# EasyEDA Pro project 直插式交直流电流检测.epro

# Schematic Schematic3_1
Board Name: 基于CC6920的电流采样; Create Date: 2026-01-25; Page Name: P1; Project Name: 逆变集成板; Schematic Name: Schematic3_1; Update Date: 2026-01-25; Company: Werner; Page Size: A4; Version: V1.0
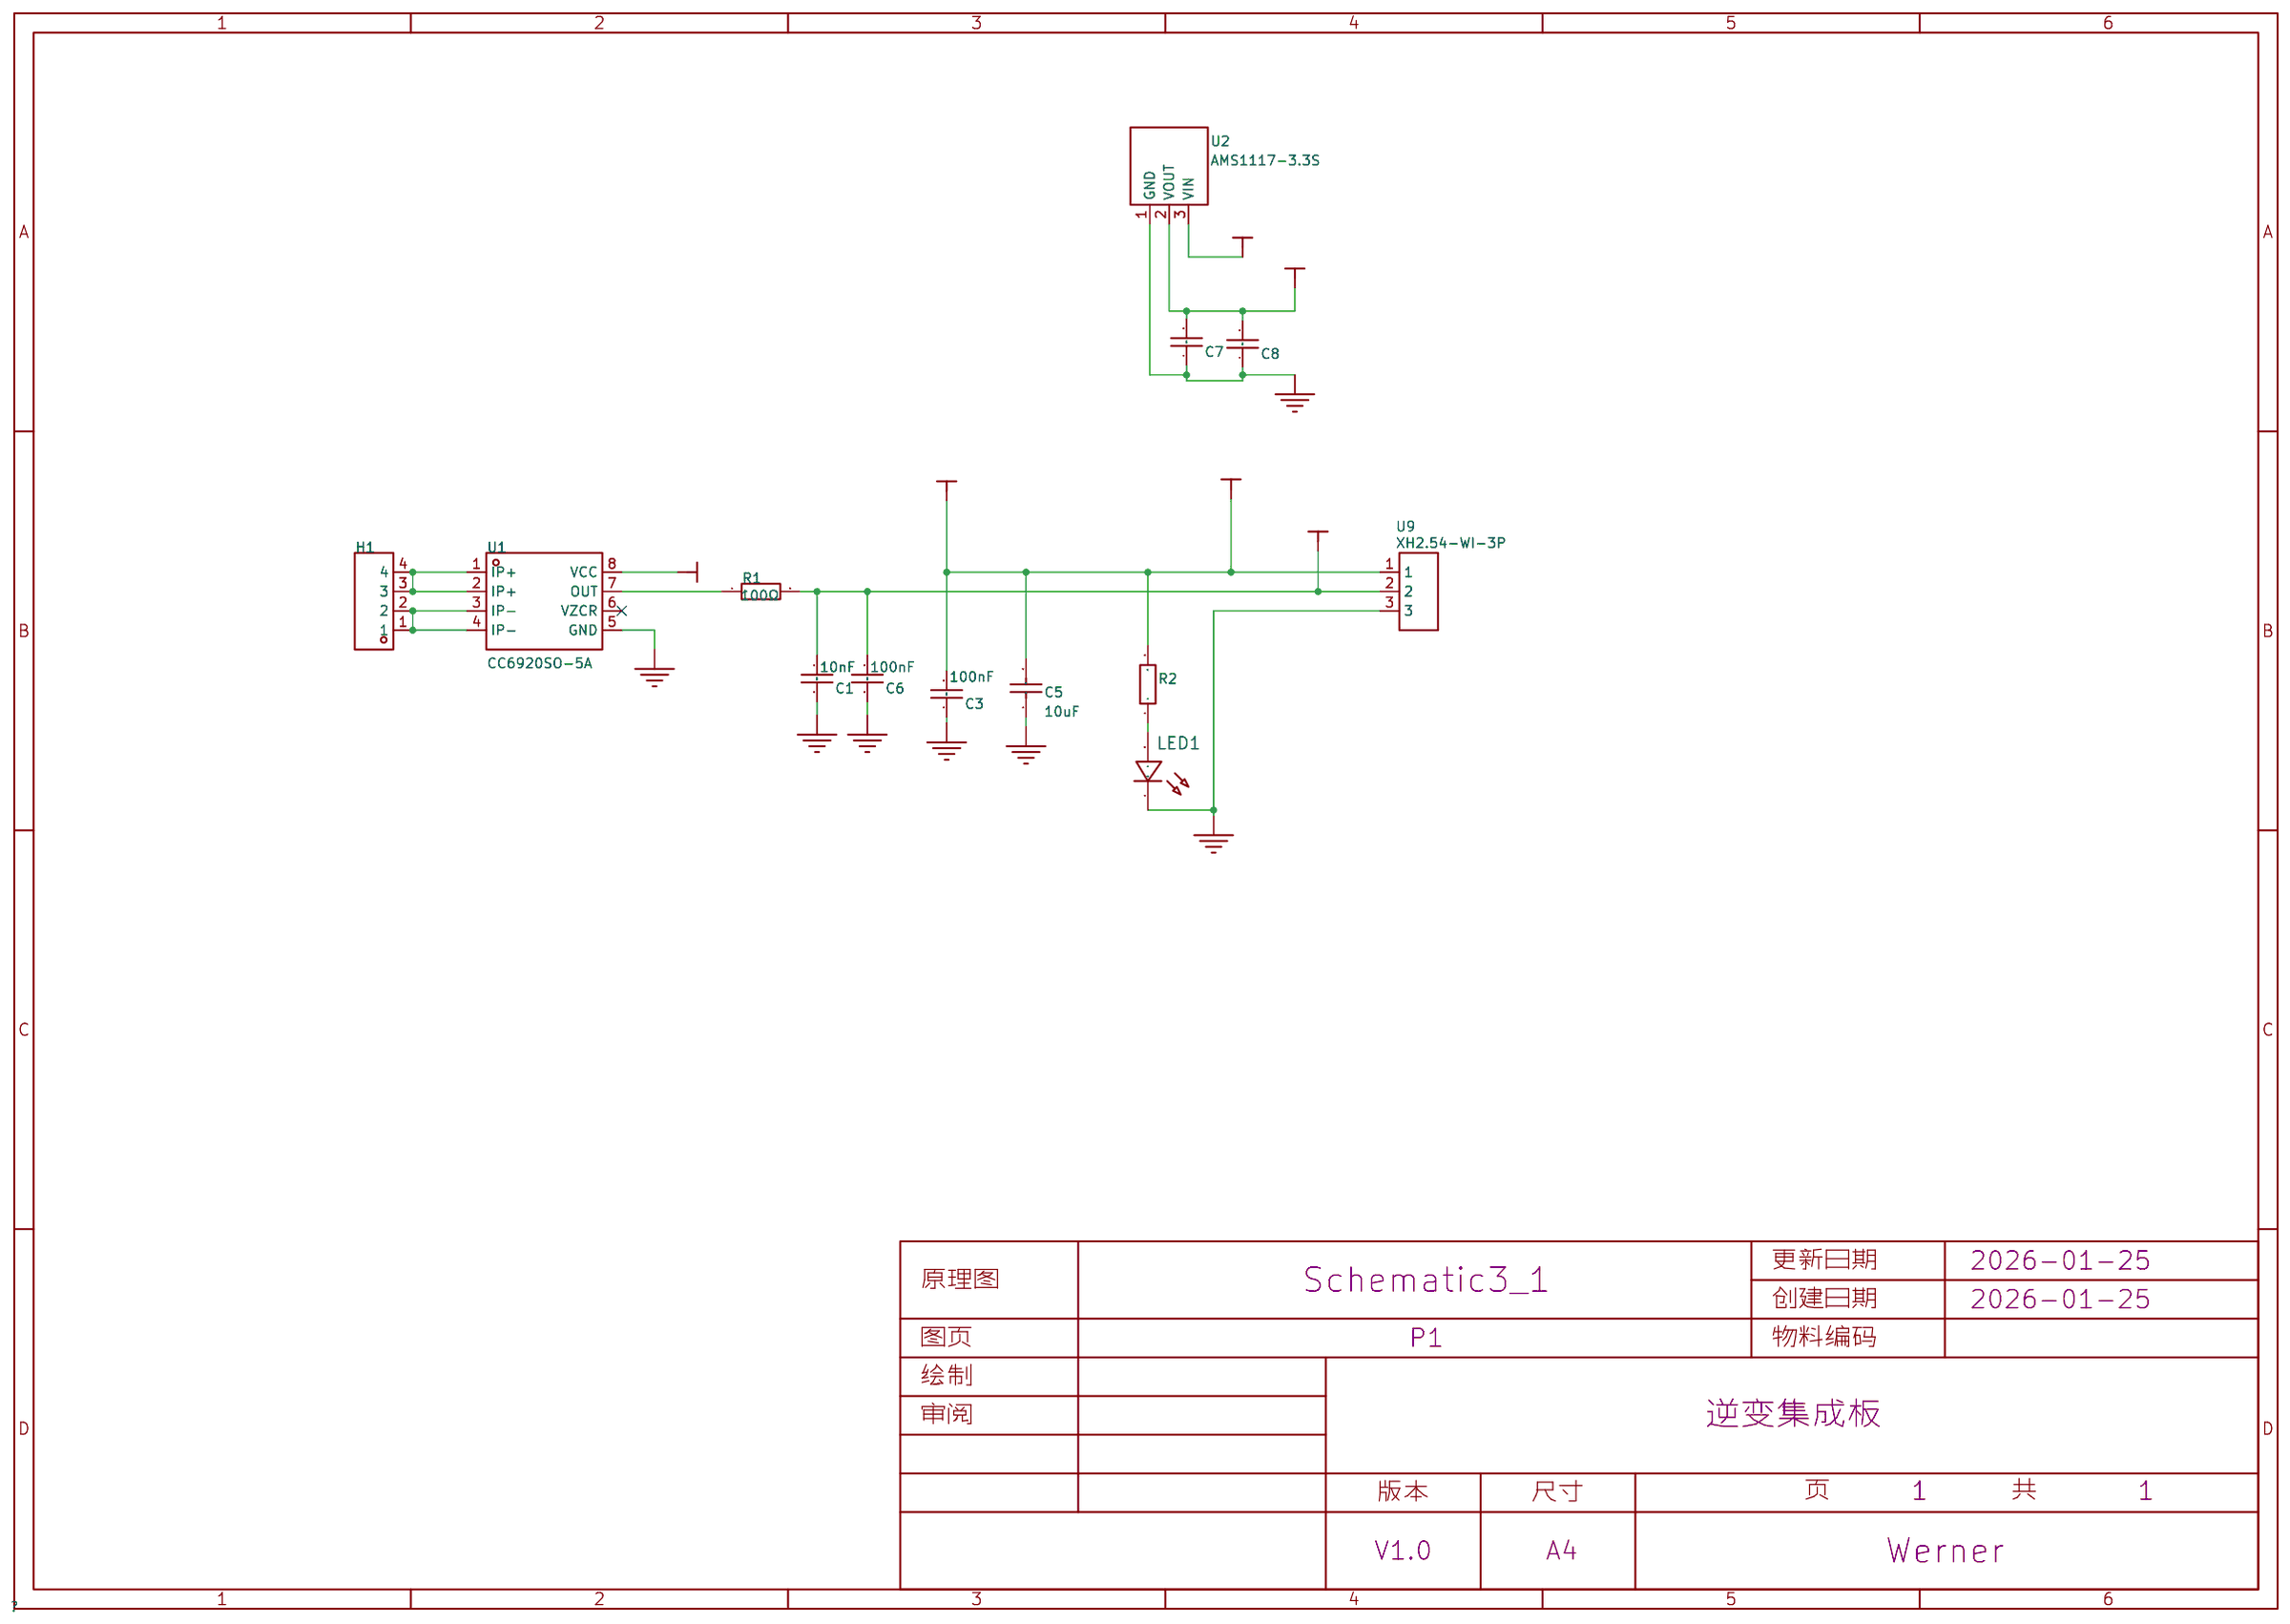
[diagram p0: schematic sheet]

## Parts
C1  10nF  [C0603]
C3  100nF  [C0603]
C5  10uF  [C0603]
C6  100nF  [C0603]
C7  -  [C0603]
C8  -  [C0603]
H1  PZ254V-11-04P  [HDR-TH_4P-P2.54-V-M]
LED1  -  [LED_604]
R1  100Ω  [Res_0603]
R2  -  [Res_0603]
U1  CC6920SO-5A  [SOP-8_L4.9-W3.9-P1.27-LS6.0-BL]
U2  AMS1117-3.3S  [SOT-89-3_L4.5-W2.5-P1.50-LS4.2-BR]
U9  XH2.54-WI-3P  [CONN-TH_XH2.54-WI-3P]

## Library data of the parts
C1 C3 C6-C8 = C0603
C5 = C1206: LCSC Part Name: 100nF ±10% 50V; Supplier Part: C24497; Manufacturer: SAMSUNG(三星); Manufacturer Part: CL31B104KBCNNNC; Supplier Footprint: 1206; JLCPCB Part Class: Basic Part; Datasheet: https://atta.szlcsc.com/upload/public/pdf/source/20160218/1457707763339.pdf; Supplier: LCSC; Tolerance: ±10%; Voltage Rated: 50V; Temperature Coefficient: X7R
H1 = PZ254V-11-04P: LCSC Part Name: 间距:2.54mm 1x4P 直插 方针; Supplier Part: C2691448; Manufacturer: XFCN(兴飞); Supplier Footprint: 插件,P=2.54mm; JLCPCB Part Class: 扩展库; Datasheet: https://atta.szlcsc.com/upload/public/pdf/source/20200309/C492403_F9F19131791D08044AD4F84F8E751A34.pdf; Supplier: LCSC; Pin Structure: 1x4P; Pitch: 2.54mm; Circluar Pins/Square Pins: 方针; Mounting Type: 直插; Number of Rows: 单排; Number of Pins: 4P; Current Rating (Max): 3A; Voltage Rating (Max): 250V; Length of Mating Pin: 6mm; Insulation Height: 2.5mm; Length of End Connection Pin: 3mm; Operating Temperature Range: -40℃~+105℃; Color: 黑色
LED1 = LED_0603-R_1: Supplier Footprint: 0603
R1 R2 = R0603
U1 = CC6920SO-5A: Supplier Part: C2760487; Manufacturer: CrossChip(成都芯进); Supplier Footprint: SOP-8; JLCPCB Part Class: 扩展库; Datasheet: https://item.szlcsc.com/datasheet/CC6920SO-5A/2881674.html; Supplier: LCSC; Current Range: -5A~5A; Voltage - Supply: 5V; Isolation Voltage(Vrms): 3500Vrms; Sensitivity: 400mV/A; Standby Current: 20mA; Operating Temperature: -40℃~+125℃
U2 = AMS1117-3.3S_C347256: LCSC Part Name: 输出:3.3V 电流:1A 耐压:18V; Supplier Part: C347256; Manufacturer: UMW(友台半导体); Supplier Footprint: SOT-89; JLCPCB Part Class: 扩展库; Datasheet: https://item.szlcsc.com/datasheet/AMS1117-3.3S/323916.html; Supplier: LCSC; Output Type: 固定; Voltage - Supply: 18V; Output Voltage: 3.3V; Output Current: 1A; Power Supply Rejection Ratio (PSRR): 60dB@(120Hz); Voltage Dropout: 1.3V@(1A); standby current: 5mA; Noise: 0.003%Vout; Features: 过流保护; Operating Temperature: -40℃~+125℃; Output Configuration: 正极; Number of Outputs: 1
U9 = XH2.54-WI-3P: Supplier: LCSC; Supplier Part: C9900005531; Manufacturer: null; JLCPCB Part Class: Extended Part

## Nets
3V3: C7.2 C8.2 U1.8(VCC) U2.2(VOUT)
5V: C3.2 C5.2 R2.2 U2.3(VIN) U9.1
GND: C1.1 C3.1 C5.1 C6.1 C7.1 C8.1 LED1.1(C) U1.5(GND) U2.1(GND) U9.3
VOUT: C1.2 C6.2 R1.2 U9.2
$1N207: H1.3 H1.4 U1.1(IP+) U1.2(IP+)
$1N211: H1.1 H1.2 U1.3(IP-) U1.4(IP-)
$1N245: R1.1 U1.7(OUT)
$1N792: LED1.2(A) R2.1

Not connected (* = marked no-connect by the designer): U1 6(VZCR)*

# Board PCB3_1
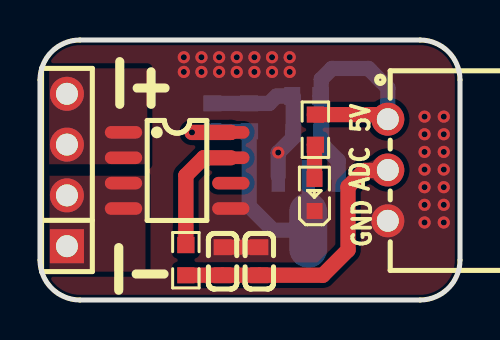
[diagram p1: board, top side]
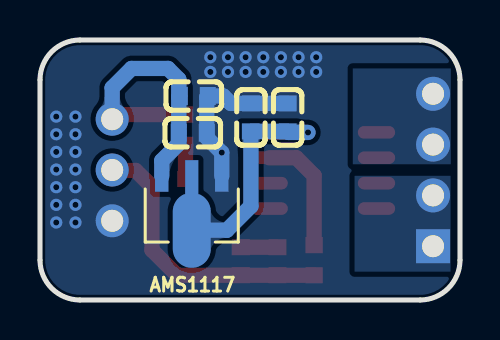
[diagram p2: board, bottom side, seen from below]

Outline 21 x 13 mm; copper layers: Top Layer, Bottom Layer. Coordinates in mm from the lower left corner of the outline.
Outline path: 0,11 0,2 arc(0.59,0.59) 2,0 19,0 arc(20.41,0.59) 21,2 21,11 arc(20.41,12.41) 19,13 2,13 arc(0.59,12.41) 0,11
Stack: Top Layer 0.035mm / Dielectric1 1.51mm FR4 er 4.5 / Bottom Layer 0.035mm

## Design rules (mm)
spacing copperThickness1oz (default): track to track 0.102, other pairs 0.152 to 0.3
spacing copperThickness2oz: track to track 0.203, other pairs 0.152 to 0.3
spacing Plane_innerPlane: track to track 0.102, other pairs 0.152 to 0.3
spacing Copper_copperRegion: track to track 0.102, other pairs 0.152 to 0.3
track width copperThickness1oz (default): min 0.127, default 0.254, max 2.54
track width copperThickness2oz: min 0.203, default 0.254, max 2.54
differential pair differentialPair (default): width min 0.127, default 0.254, max 2.54; gap min 0.152, default 0.152
pour e80 uses Copper_copperRegion
pour e82 uses Copper_copperRegion

## Placement (name value [footprint] x y rotation side)
AMS1117  AMS1117-3.3S  [SOT-89-3_L4.5-W2.5-P1.50-LS4.2-BR]  13.41 4.85 90 bottom
C1  10nF  [C0603]  9.13 1.94 270 top
C3  100nF  [C0603]  13.31 10.2 0 bottom
C5  10uF  [C0603]  13.36 8.36 0 bottom
C6  100nF  [C0603]  10.97 1.94 270 top
C7  -  [C0603]  10.46 9.13 270 bottom
C8  -  [C0603]  8.62 9.13 270 bottom
H1  PZ254V-11-04P  [HDR-TH_4P-P2.54-V-M]  1.35 6.5 90 top
LED1  -  [LED_604]  13.72 5.3 90 top
R1  100Ω  [Res_0603]  7.29 1.99 270 top
R2  -  [Res_0603]  13.77 8.52 90 top
U1  CC6920SO-5A  [SOP-8_L4.9-W3.9-P1.27-LS6.0-BL]  6.86 6.48 270 top
U9  XH2.54-WI-3P  [CONN-TH_XH2.54-WI-3P]  17.39 6.5 270 top

## Footprints (pads in the part's own frame, mm; a bottom-side part is the same pattern mirrored in y, then rotated)
C0603
  rect 0.8x0.9 smd: 1(-0.7,0) 2(0.7,0)
CONN-TH_XH2.54-WI-3P
  round 1.65 hole 1.1: 1(-2.54,0) 2(0,0) 3(2.54,0)
HDR-TH_4P-P2.54-V-M
  rect 1.7x1.7 hole 1.1: 1(-3.81,0)
  round 1.7 hole 1.1: 2(-1.27,0) 3(1.27,0) 4(3.81,0)
LED_604
  rect 0.8x0.8 smd: 1(-0.851,-0.01) 2(0.75,-0.005)
Res_0603
  rect 0.806x0.864 smd: 1(-0.754,0) 2(0.752,0)
SOP-8_L4.9-W3.9-P1.27-LS6.0-BL
  oval 0.63x1.865 smd: 1(-1.905,-2.683) 2(-0.635,-2.683) 3(0.635,-2.683) 4(1.905,-2.683) 5(1.905,2.683) 6(0.635,2.683) 7(-0.635,2.683) 8(-1.905,2.683)
SOT-89-3_L4.5-W2.5-P1.50-LS4.2-BR
  rect 1.575x0.672 smd: 1(1.356,-1.5) 3(1.356,1.5)
  custom 5.377x1.9 smd: 2(-1.356,0)

## Nets
3V3: AMS1117.2 C7.2 C8.2 U1.8
5V: AMS1117.3 C3.2 C5.2 R2.2 U9.1
GND: AMS1117.1 C1.1 C3.1 C5.1 C6.1 C7.1 C8.1 LED1.1 U1.5 U9.3
VOUT: C1.2 C6.2 R1.2 U9.2
$1N207: H1.3 H1.4 U1.1 U1.2
$1N211: H1.1 H1.2 U1.3 U1.4
$1N245: R1.1 U1.7
$1N792: LED1.2 R2.1

Pads without a net: U1 6

## Via types
v1: diameter 0.61, hole 0.305, Top Layer to Bottom Layer, 30 vias

## Routing (per net, layer and track width the routed paths; a pad name or vN(x,y) marks a point on that pad's centre or on a via; arc(x,y) is an arc through that point)
3V3: length 12
  Top Layer w0.762: v1(7.6,8.38) 9.54,8.38 U1.8
  Bottom Layer w0.762: AMS1117.2 11.66,3.49 10.46,4.69 C7.2 C8.2 8.57,8.38 v1(7.6,8.38)
5V: length 14.5
  Top Layer w0.762: 13.72,9.27 17.16,9.27 U9.1
  Bottom Layer w0.762: 14.06,10.15 C5.2 14.06,7.82 14.91,6.97 AMS1117.3 ; 14.06,10.15 C3.2 ; 14.06,10.15 14.06,11.04 14.6,11.58 16.42,11.58 17.39,10.61 U9.1
GND: length 10.3
  Top Layer w0.762: C1.1 C6.1
  Bottom Layer w0.762: AMS1117.1 v1(11.91,7.37) 12.66,8.12 C5.1 12.66,10.15 C3.1 11.83,10.2 11.46,9.83 8.62,9.83
  vias: v1(7.19,12.14) v1(7.19,11.4) v1(8.07,12.14) v1(8.07,11.4) v1(8.96,12.14) v1(8.96,11.4) v1(9.84,12.14) v1(9.84,11.4) v1(10.72,12.14) v1(10.72,11.4) v1(11.6,12.14) v1(11.6,11.4) v1(12.48,12.14) v1(12.48,11.4) v1(19.23,9.17) v1(19.23,8.29) v1(19.23,7.4) v1(19.23,6.52) v1(19.23,5.64) v1(19.23,4.76) v1(19.23,3.88) v1(20.19,9.17) v1(20.19,8.29) v1(20.19,7.4) v1(20.19,6.52) v1(20.19,5.64) v1(20.19,4.76) v1(20.19,3.88)
VOUT: length 14.1
  Top Layer w0.762: 10.96,1.24 R1.2 ; U9.2 17.37,6.48 16.22,6.48 15.4,5.66 15.4,2.5 14.14,1.24 C6.2
$1N245: length 6.1
  Top Layer w0.762: R1.1 7.29,6.22 8.18,7.11 U1.7
$1N792: length 1.7
  Top Layer w0.762: 13.72,7.76 13.72,7.76 LED1.2

## Copper pours and planes (outline as drawn; the poured copper is in the pictures)
GND on Top Layer: -2.19,15.5 24.12,15.5 24.12,-1.17 -2.19,-1.17
GND on Bottom Layer: -1.94,13.97 24.58,13.97 24.58,-0.61 -1.94,-0.61
$1N207 on Top Layer: 0.46,11.58 5.36,11.58 5.36,6.79 0.46,6.79
$1N207 on Bottom Layer: 0.46,11.58 5.36,11.58 5.36,6.79 0.46,6.79
$1N211 on Top Layer: 0.47,6.21 5.27,6.21 5.27,1.42 0.47,1.42
$1N211 on Bottom Layer: 0.47,6.21 5.27,6.21 5.27,1.42 0.47,1.42

Small or netless copper shapes (teardrops, artwork), in the pictures only: 9 on Top Layer, 16 on Bottom Layer

## Text on the board
Top Silkscreen Layer: ADC | 5V | GND | I- | I+
